# Altium project ESP32_SERVO.PrjPcb
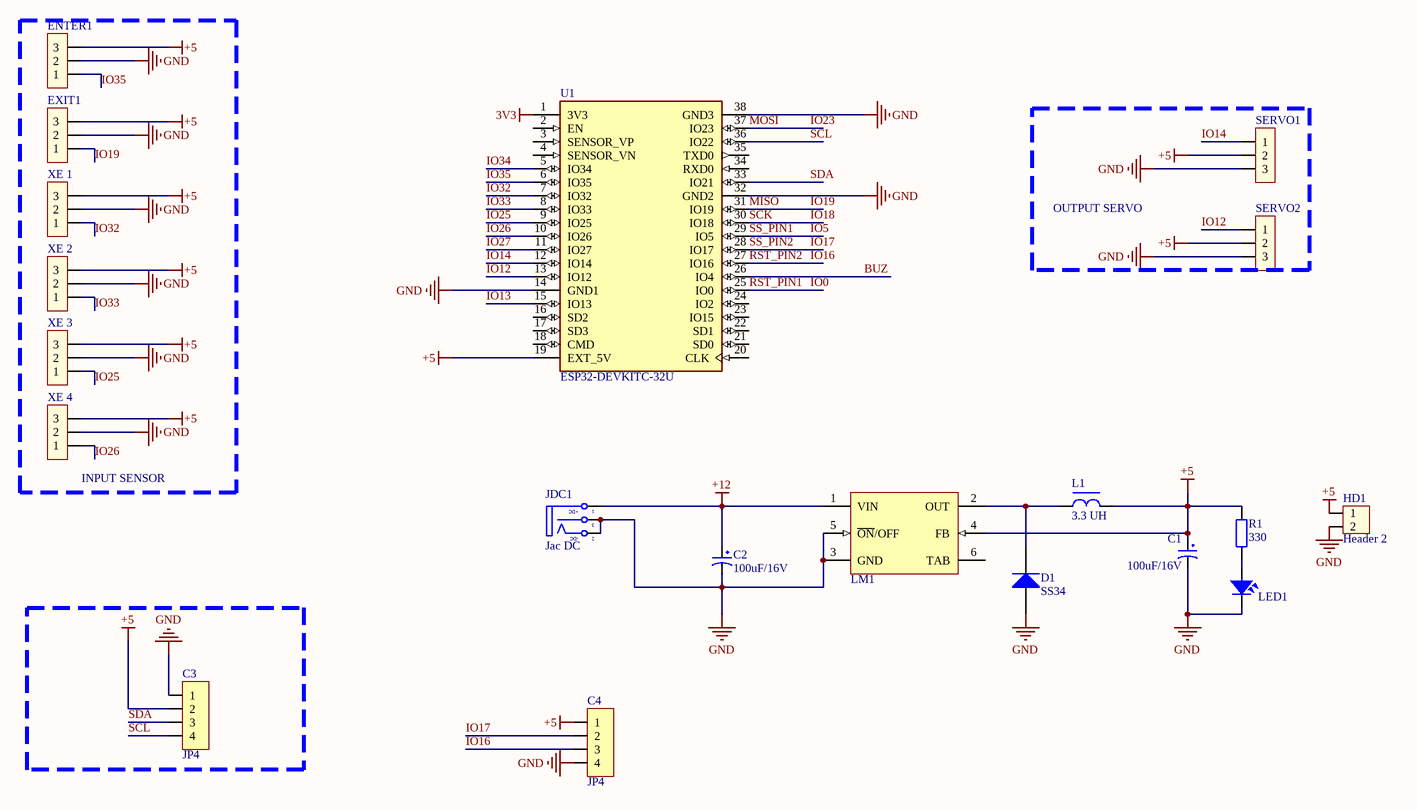
[diagram p0: ESP32_SERVO.SchDoc]
1 sheet, 20 parts. Net scope: global (net labels, ports and power ports of the same name join across sheets).
Board file: ESP32_SERVO.PcbDoc

## Sheet ESP32_SERVO.SchDoc
size A3

### Parts
C1  100uF/16V  [CP1.5/3.4]
C2  100uF/16V  [CP1.5/3.4]
C3  JP4  [JP4-C1T]
C4  JP4  [JP4-C1T]
D1  SS34  [DIODE SMA]
ENTER1  (no value)  [JP3]
EXIT1  (no value)  [JP3]
HD1  Header 2  [HED2]
JDC1  Jac DC  [DC-IN]
L1  3.3 UH  [L-DIP-M-7.8]
LED1  LED  [LED-3]  (value not drawn)
LM1  LM2576  [QTO-220-5-1H1]  (value not drawn)
R1  330  [R1/4WD]
SERVO1  (no value)  [JP3]
SERVO2  (no value)  [JP3]
U1  ESP32-DEVKITC-32U  [MODULE_ESP32-DEVKITC-32U]
XE_1  (no value)  [JP3]
XE_2  (no value)  [JP3]
XE_3  (no value)  [JP3]
XE_4  (no value)  [JP3]

### Blocks framed on the sheet
INPUT SENSOR: ENTER1 EXIT1 XE_1-XE_4
OUTPUT SERVO: SERVO1 SERVO2

### Nets
3V3: U1.1(3V3)
+5: C1.1 C3.2 C4.1 ENTER1.3 EXIT1.3 HD1.1 L1.2 LM1.4(FB) R1.2 SERVO1.2 SERVO2.2 U1.19(EXT_5V) XE_1.3 XE_2.3 XE_3.3 XE_4.3
+12: C2.1 JDC1.1(T) LM1.1(VIN)
GND: C1.2 C2.2 C3.1 C4.4 D1.1(A) ENTER1.2 EXIT1.2 HD1.2 JDC1.2(TN) JDC1.3(S) LED1.2 LM1.3(GND) LM1.5(~{ON}/OFF) SERVO1.3 SERVO2.3 U1.14(GND1) U1.32(GND2) U1.38(GND3) XE_1.2 XE_2.2 XE_3.2 XE_4.2
BUZ: U1.26(IO4)
IO0: U1.25(IO0)  [also labelled RST_PIN1]
IO5: U1.29(IO5)  [also labelled SS_PIN1]
IO12: SERVO2.1 U1.13(IO12)
IO13: U1.15(IO13)
IO14: SERVO1.1 U1.12(IO14)
IO16: C4.3 U1.27(IO16)  [also labelled RST_PIN2]
IO17: C4.2 U1.28(IO17)  [also labelled SS_PIN2]
IO18: U1.30(IO18)  [also labelled SCK]
IO19: EXIT1.1 U1.31(IO19)  [also labelled MISO]
IO23: U1.37(IO23)  [also labelled MOSI]
IO25: U1.9(IO25) XE_3.1
IO26: U1.10(IO26) XE_4.1
IO27: U1.11(IO27)
IO32: U1.7(IO32) XE_1.1
IO33: U1.8(IO33) XE_2.1
IO34: U1.5(IO34)
IO35: ENTER1.1 U1.6(IO35)
SCL: C3.4 U1.36(IO22)
SDA: C3.3 U1.33(IO21)
NetD1_2: D1.2(K) L1.1 LM1.2(OUT)
NetLED1_1: LED1.1 R1.1

Not connected (* = marked no-connect by the designer): LM1 6(TAB); U1 2(EN) 3(SENSOR_VP) 4(SENSOR_VN) 16(SD2) 17(SD3) 18(CMD) 20(CLK) 21(SD0) 22(SD1) 23(IO15) 24(IO2) 34(RXD0) 35(TXD0)

### Notes on the sheet
- (in symbol DCIN) +DC; -DC

### Library data of the parts
C1 C2 = CP4: Cap 1000uF/16V - 220uF/50V; Description 5: 4,7uF>10uF/250V_3,3uF>10uF/400V - 2,2uF>4,7uF/450V; Description 1: 2200uF-3300uF/6,3V - 1000uF-2200uF/10V; Description 2: 1000uF/16V - 470uF => 1000uF/25V - 100uF/100V; Description 3: 330uF>470uF/35V_220uF>470uF/50V_10uF>22uF/250V; Description 4: 220uF => 330uF/63V - 10uF =>33uF/160 - 200V; Value: 1000uF/16V
C3 C4 = JP4: WR-PHD 2.54 mm Angled Socket Header; Manufacturer: W¨¹rth Elektronik eiSos GmbH; partNo: 613004143121; ComponentLink1 Description: Manufacturer; ComponentLink2 Description: Datasheet; NoPins: 04; Created Date: 29 March 2013; ComponentLink1URL: http://www.we-online.com; ComponentLink2URL: http://katalog.we-online.de/em/datasheet/6130xx143121.pdf; Created by: Karrer Zheng
D1 = Diode SS34 ( 1N5822 ): Dán; Don_Vi: Con; Ma_Hang: MH002104; Ten_Linh_Kien: Diode SS34 3A 40V SMA ( 1N5822 SS34A); Kieu_Chan: *; Chung_Loai: Dán
ENTER1 EXIT1 SERVO1 SERVO2 XE_1-XE_4 = JP3: Jumper 3; Value: J3
HD1 = Hed2: Header 2 (Green); Value: Header 2
JDC1 = DCIN: Jac DC input; Value: Jac DC
L1 = L-DIP-1: Inductor; Value: 150 mH
LED1 = LED: LED Single colour Green and Red; Value: LED 3 ly Single Colour
R1 = R1/4W: Resistor 1/4W; Value: R1/4W - 1K
U1 = ESP32-DEVKITC-32U: ESP32-DEVKITC; Package: None; Availability: Unavailable; Value: *; MP: ESP32-DEVKITC-32U; Price: None